# EAGLE schematic debugger_board (EAGLE 6.6.0)
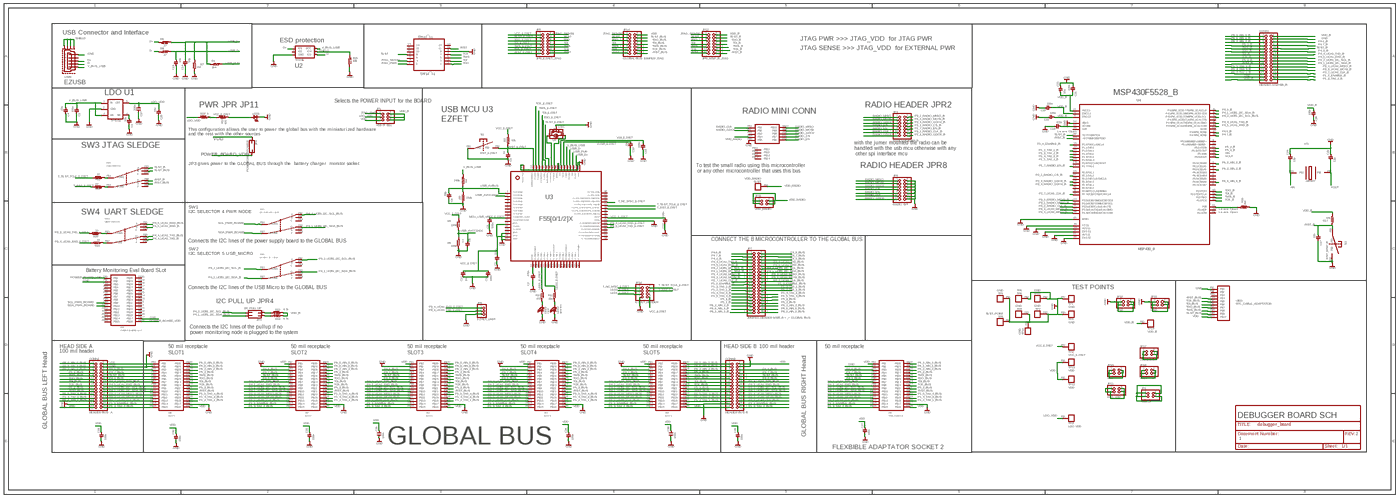
[diagram p0: schematic, sheet 1, overview]
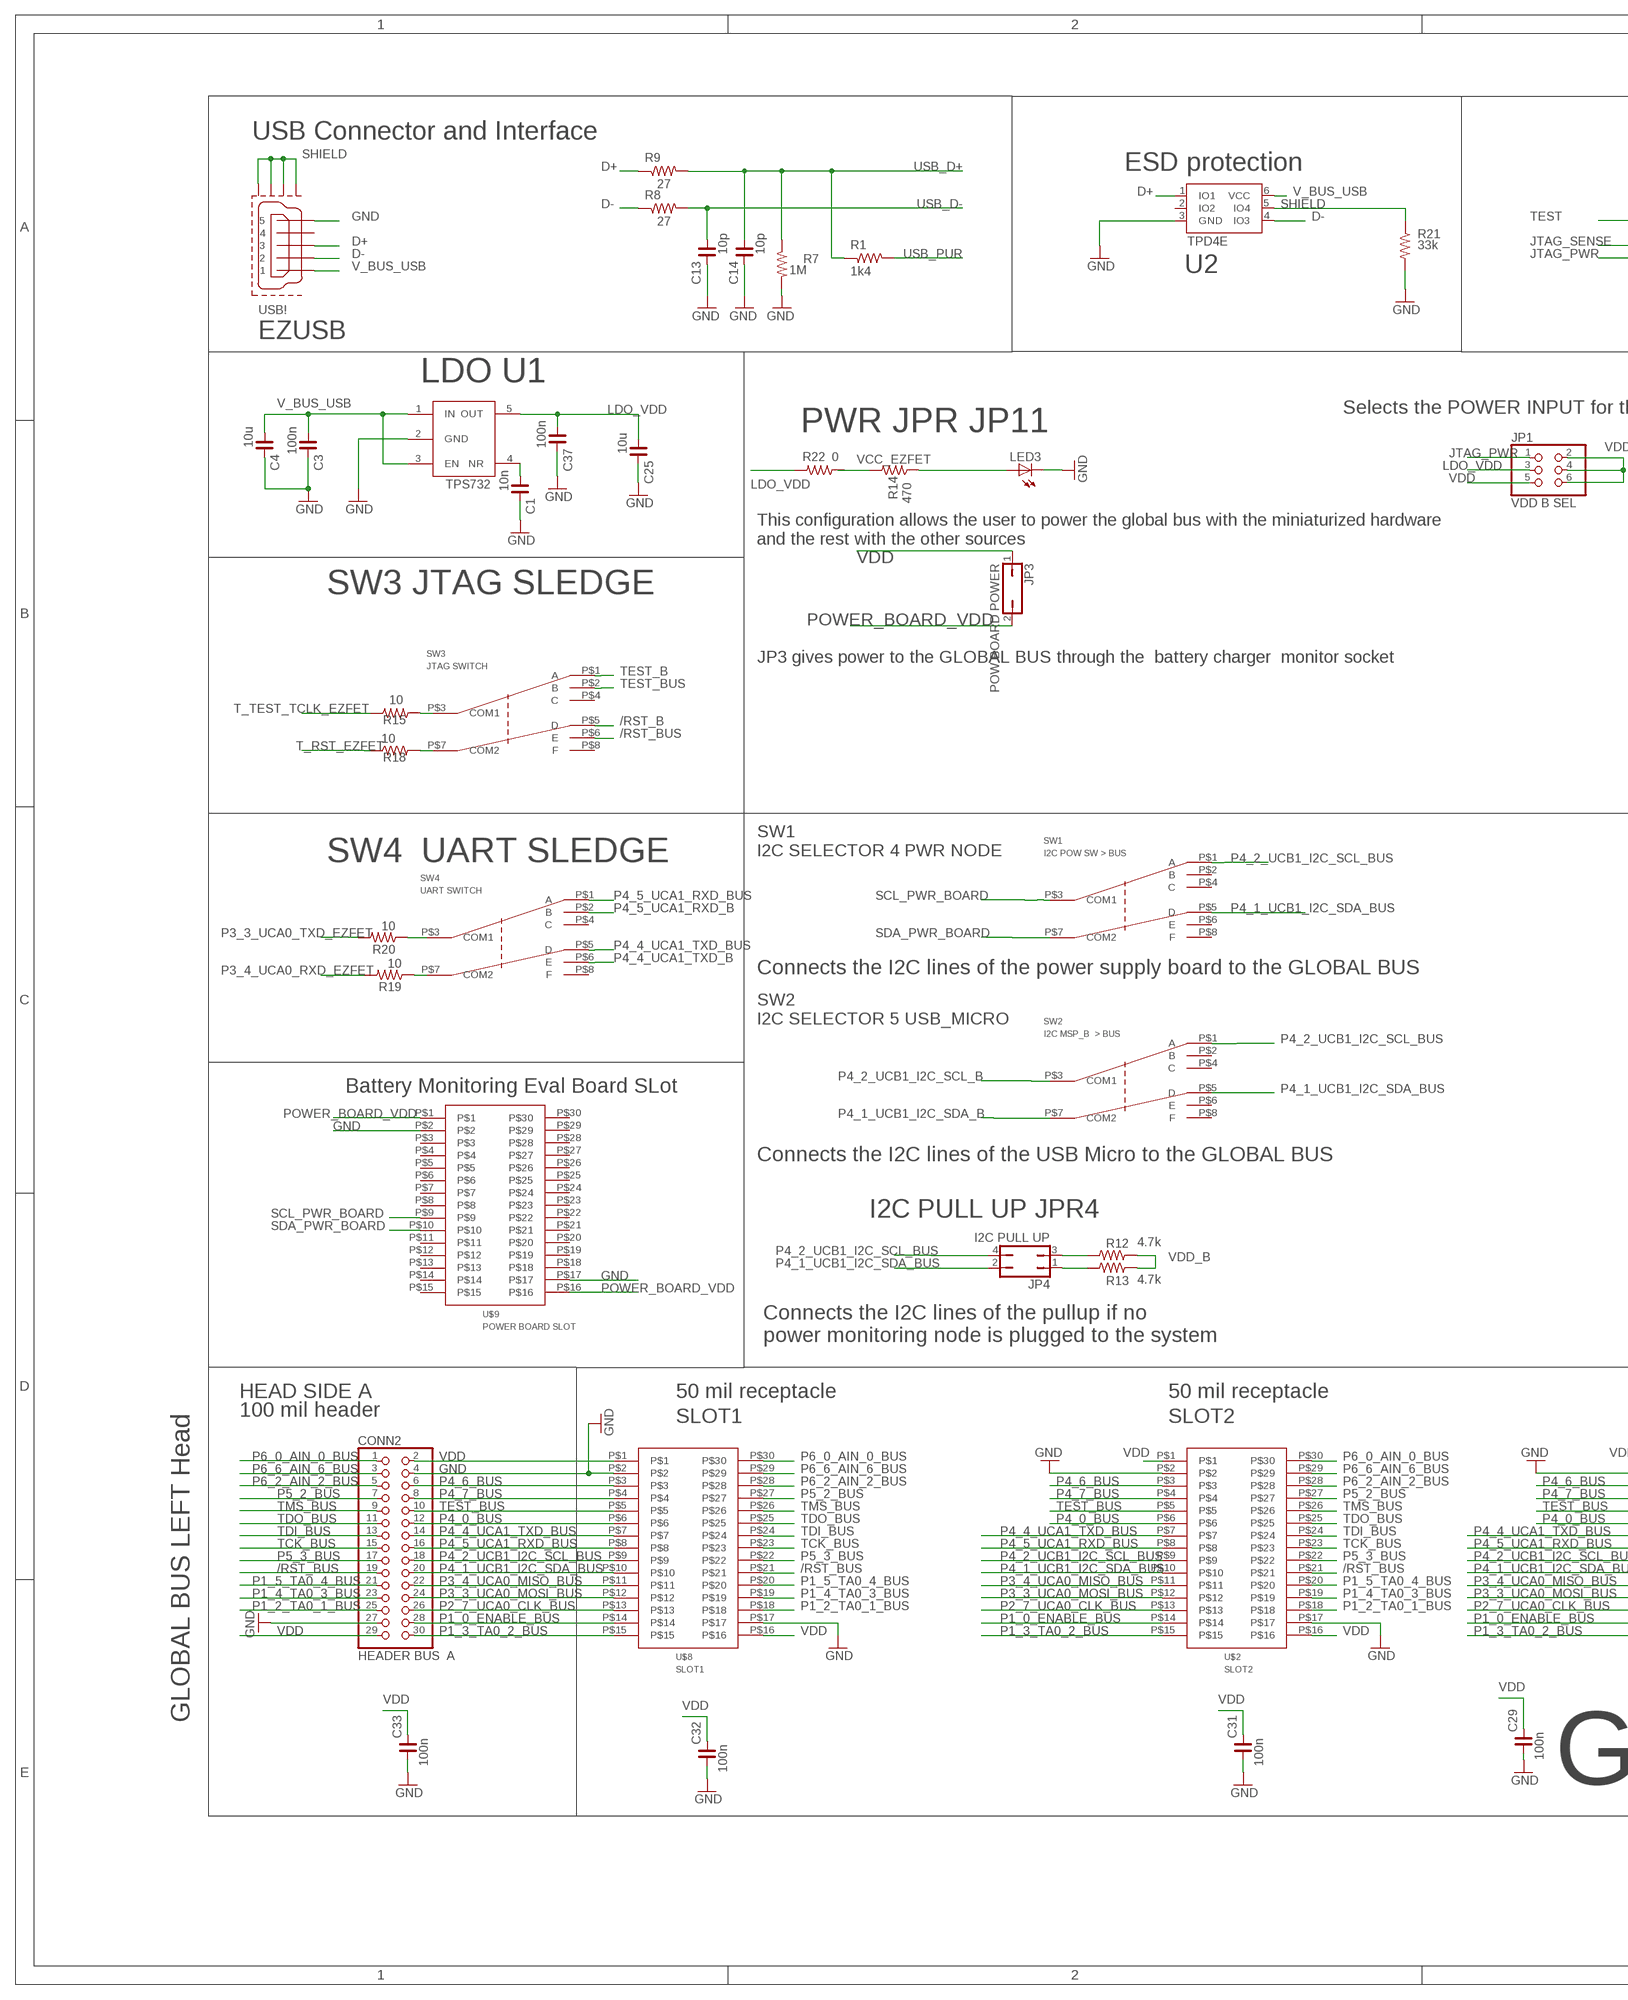
[diagram p1: schematic, sheet 1, part 1 of 4]
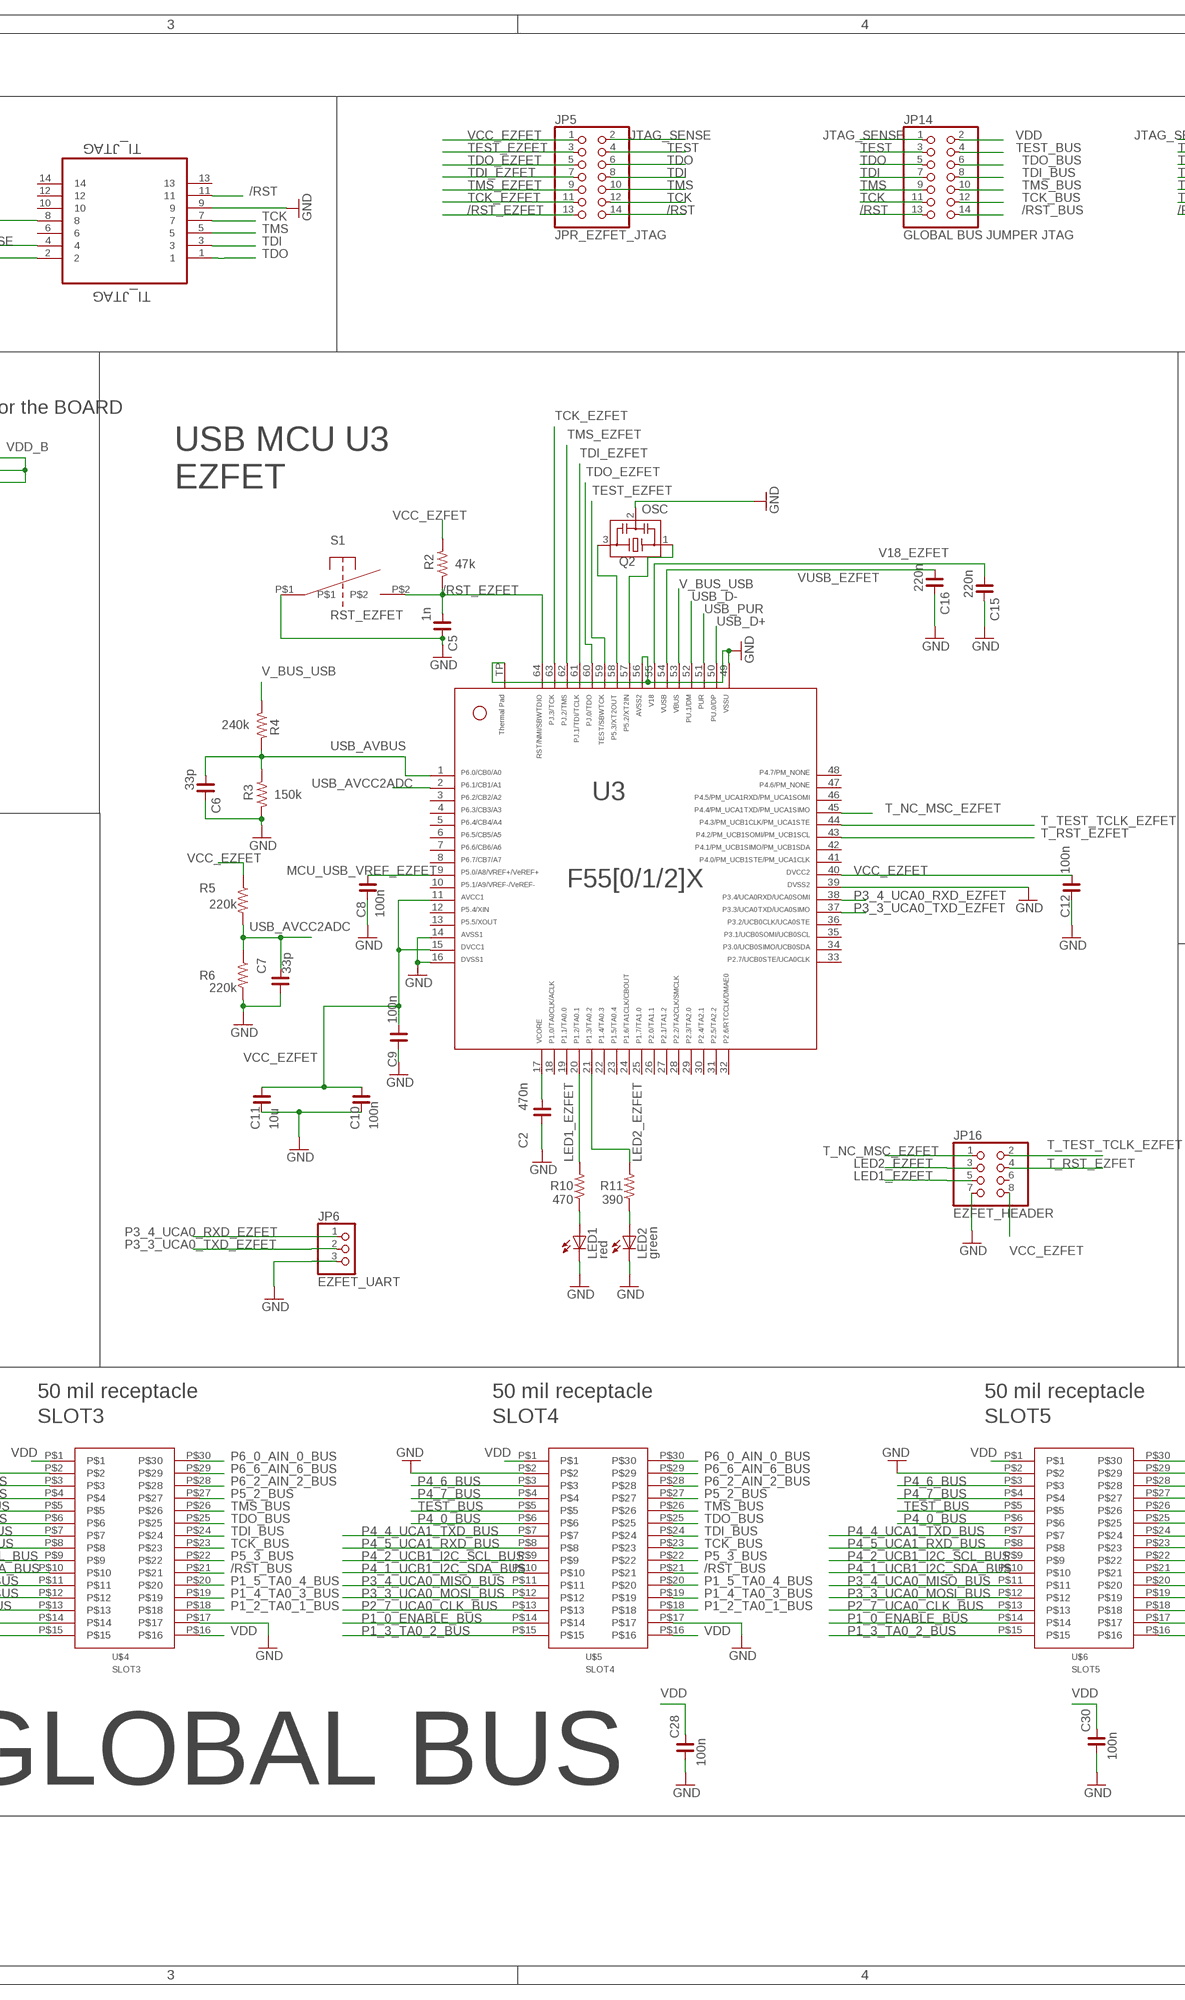
[diagram p2: schematic, sheet 1, part 2 of 4]
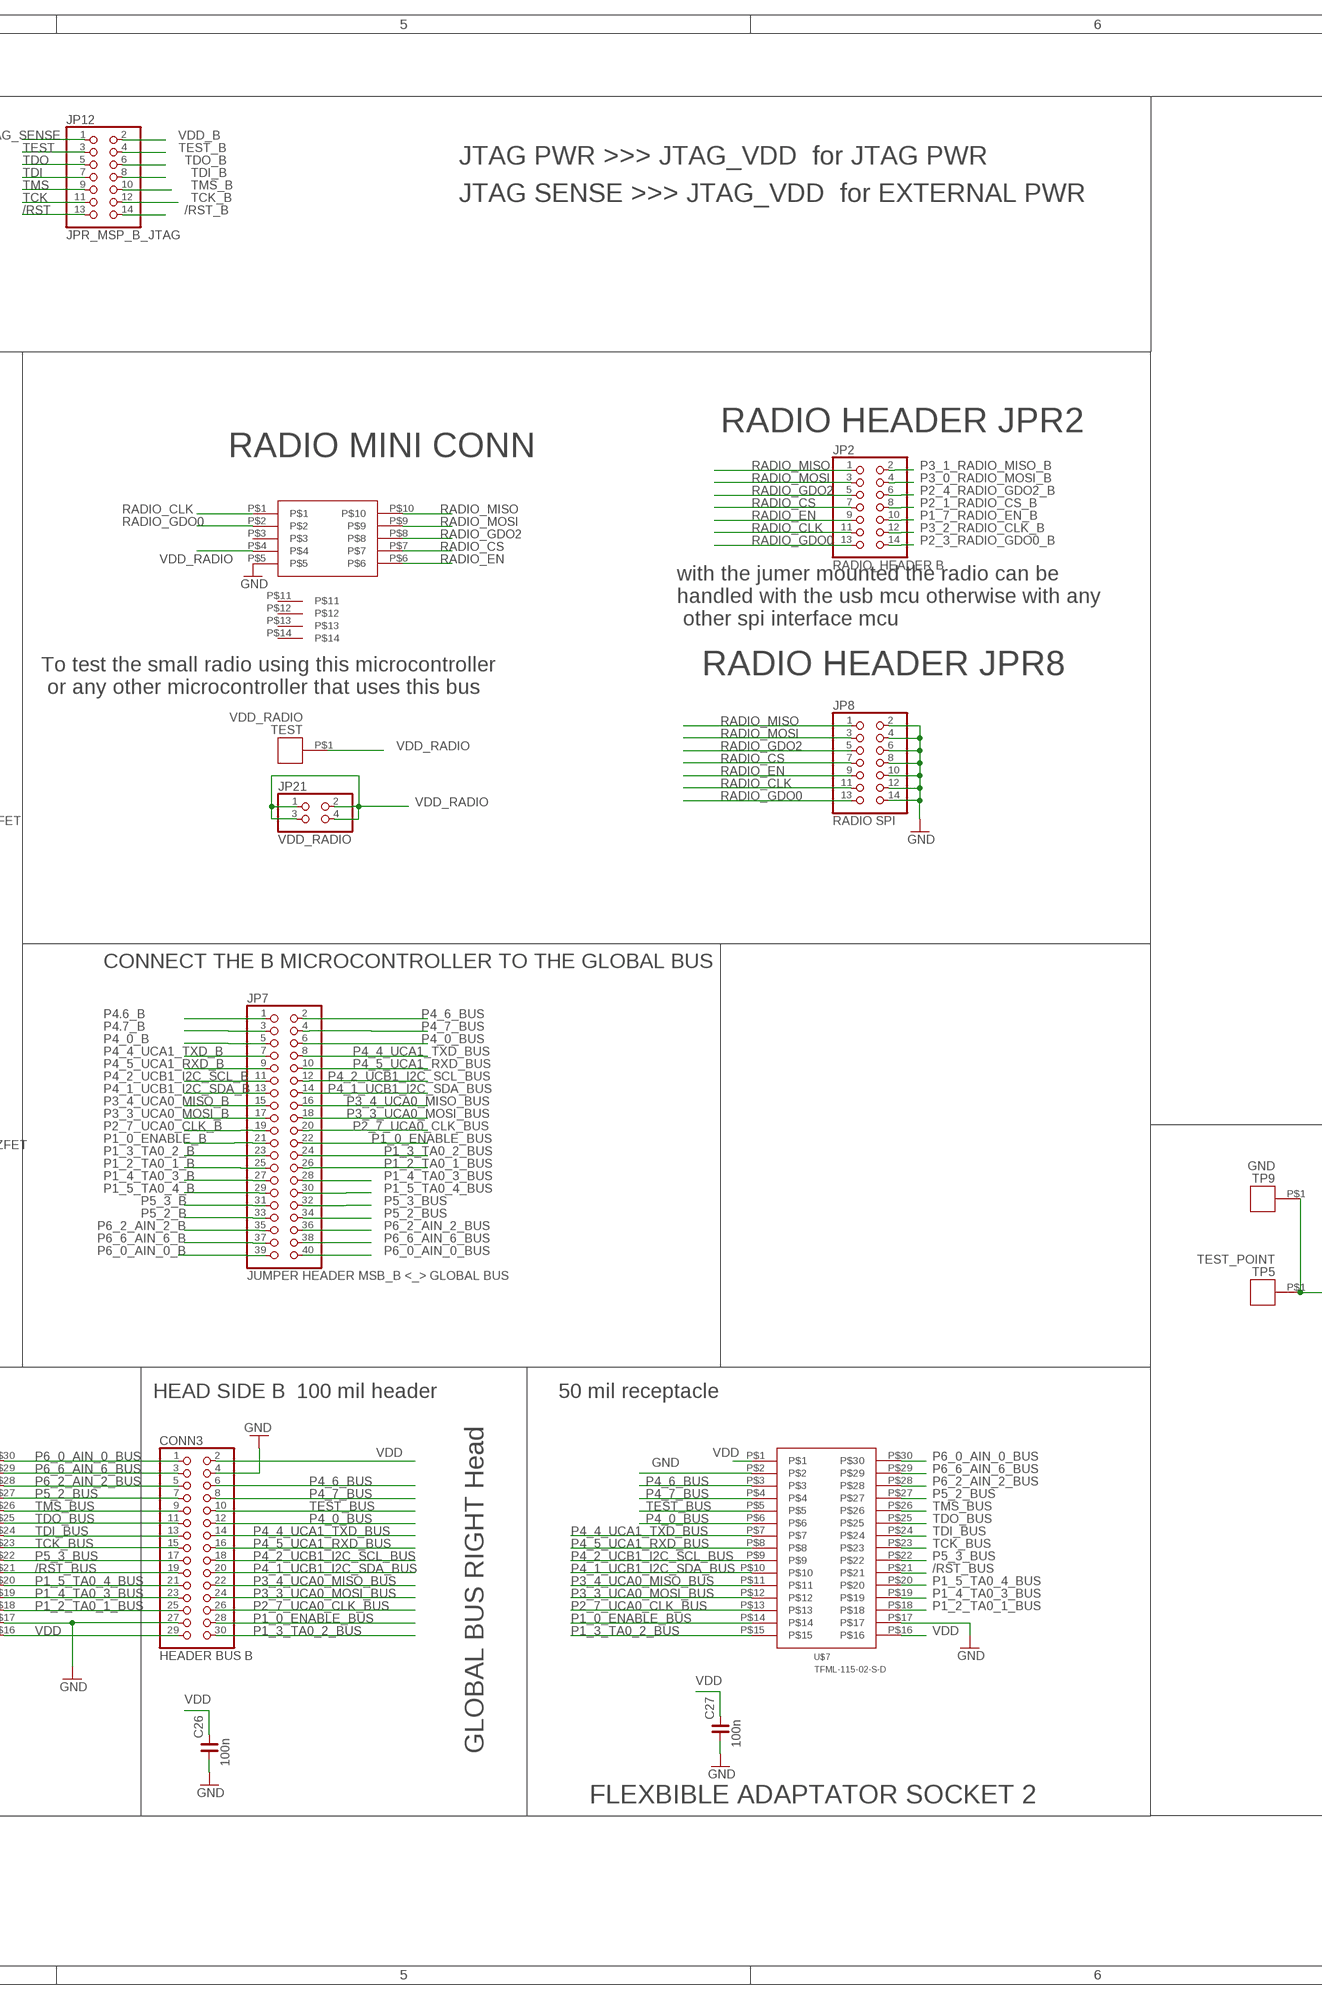
[diagram p3: schematic, sheet 1, part 3 of 4]
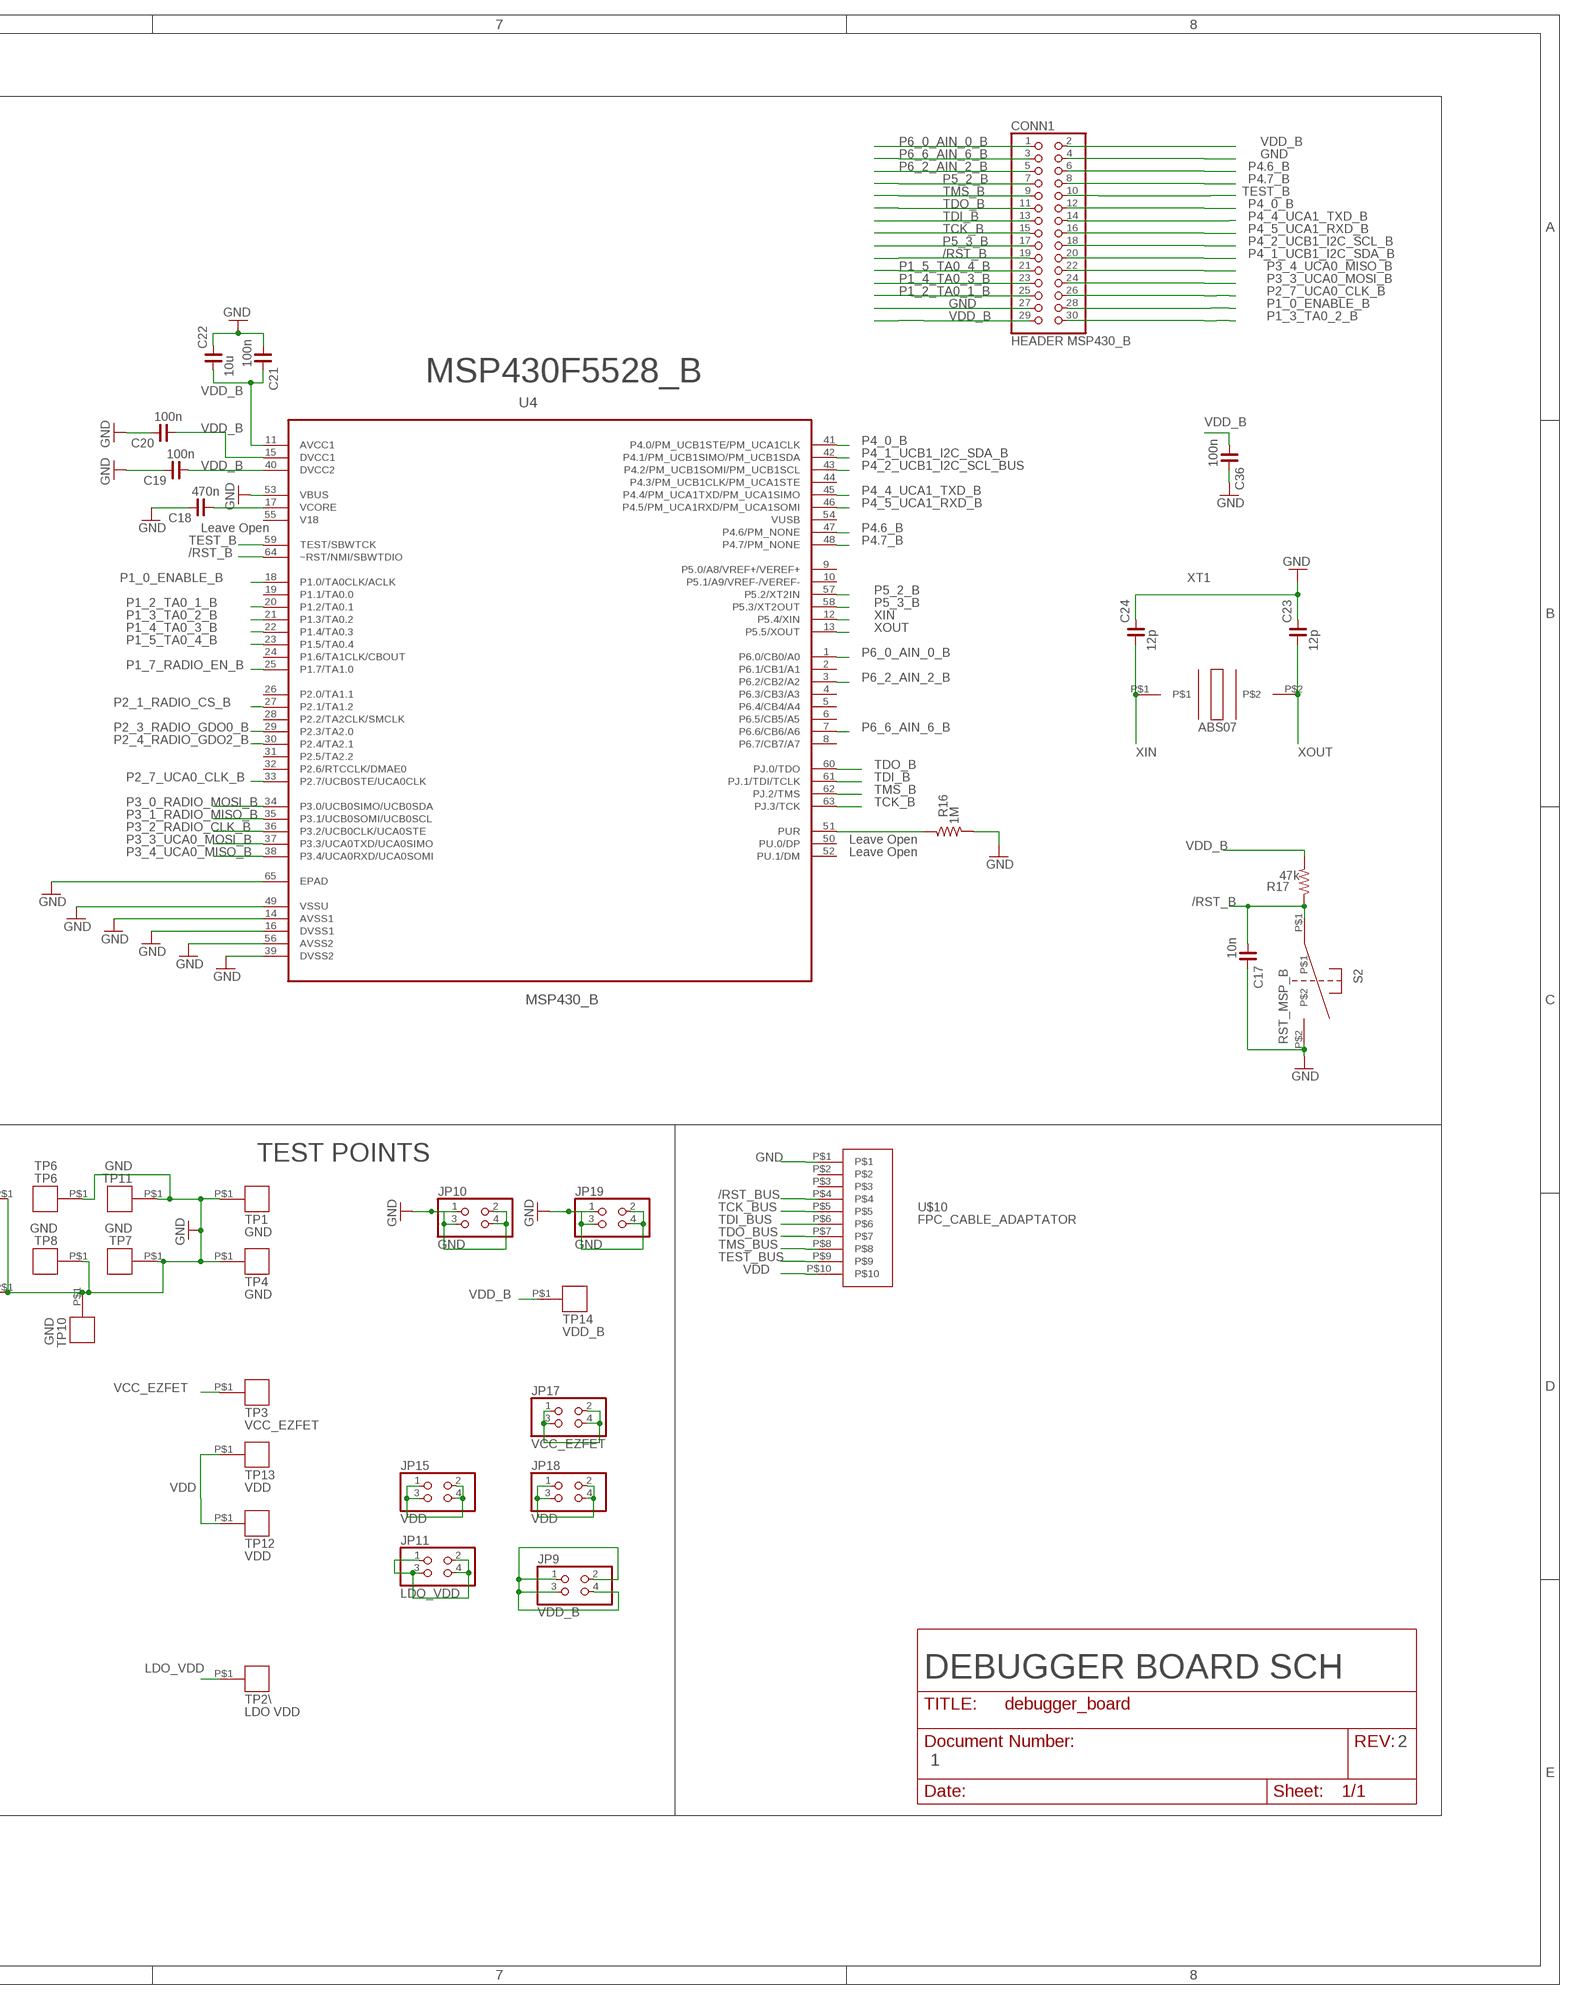
[diagram p4: schematic, sheet 1, part 4 of 4]

## Parts
C1  10n  C_0603  [C0603]
C2  470n  C_0603  [C0603]
C3  100n  C_0603  [C0603]
C4  10u  C_0603  [C0603]
C5  1n  C_0603  [C0603]
C6  33p  C_0603  [C0603]
C7  33p  C_0603  [C0603]
C8  100n  C_0603  [C0603]
C9  100n  C_0603  [C0603]
C10  100n  C_0603  [C0603]
C11  10u  C_0603  [C0603]
C12  100n  C_0603  [C0603]
C13  10p  C_0603  [C0603]
C14  10p  C_0603  [C0603]
C15  220n  C_0603  [C0603]
C16  220n  C_0603  [C0603]
C17  10n  C_0603  [C0603]
C18  470n  C_0603  [C0603]
C19  100n  C_0603  [C0603]
C20  100n  C_0603  [C0603]
C21  100n  C_0603  [C0603]
C22  10u  C_0603  [C0603]
C23  12p  C_0603  [C0603]
C24  12p  C_0603  [C0603]
C25  10u  C_0603  [C0603]
C26  100n  C_0603  [C0603]
C27  100n  C_0603  [C0603]
C28  100n  C_0603  [C0603]
C29  100n  C_0603  [C0603]
C30  100n  C_0603  [C0603]
C31  100n  C_0603  [C0603]
C32  100n  C_0603  [C0603]
C33  100n  C_0603  [C0603]
C36  100n  C_0603  [C0603]
C37  100n  C_0603  [C0603]
CONN1  HEADER MSP430_B  PINHD-2X15  [2X15]
CONN2  HEADER BUS A  PINHD-2X15  [2X15]
CONN3  HEADER BUS B  PINHD-2X15  [2X15]
EZUSB  USB!  MINI-USB-SHIELD-UX60A-MB-5ST  [UX60A-MB-5ST]
JP1  VDD B SEL  PINHD-2X3  [2X03]
JP2  RADIO_HEADER B  PINHD-2X7  [2X07]
JP3  POW BOARD POWER  JP1Q  [JP1]
JP4  I2C PULL UP  JP2Q  [JP2Q]
JP5  JPR_EZFET_JTAG  PINHD-2X7  [2X07]
JP6  EZFET_UART  PINHD-1X3  [1X03]
JP7  JUMPER HEADER MSB_B <_> GLOBAL BUS  PINHD-2X20  [2X20]
JP8  RADIO SPI  PINHD-2X7  [2X07]
JP9  VDD_B  PINHD-2X2  [2X02]
JP10  GND  PINHD-2X2  [2X02]
JP11  LDO_VDD  PINHD-2X2  [2X02]
JP12  JPR_MSP_B_JTAG  PINHD-2X7  [2X07]
JP14  GLOBAL BUS JUMPER JTAG  PINHD-2X7  [2X07]
JP15  VDD  PINHD-2X2  [2X02]
JP16  EZFET_HEADER  PINHD-2X4  [2X04]
JP17  VCC_EZFET  PINHD-2X2  [2X02]
JP18  VDD  PINHD-2X2  [2X02]
JP19  GND  PINHD-2X2  [2X02]
JP21  VDD_RADIO  PINHD-2X2  [2X02]
LED1  red  LEDCHIP-LED0603  [CHIP-LED0603]
LED2  green  LEDCHIP-LED0603  [CHIP-LED0603]
LED3  LEDCHIP-LED0603  [CHIP-LED0603]
Q2  OSC  CSTCR6M00G53Z  [CSTCR6M]
R1  1k4  R_0603  [R0603]
R2  47k  R_0603  [R0603]
R3  150k  R_0603  [R0603]
R4  240k  R_0603  [R0603]
R5  220k  R_0603  [R0603]
R6  220k  R_0603  [R0603]
R7  1M  R_0603  [R0603]
R8  27  R_0603  [R0603]
R9  27  R_0603  [R0603]
R10  470  R_0603  [R0603]
R11  390  R_0603  [R0603]
R12  4.7k  R_0603  [R0603]
R13  4.7k  R_0603  [R0603]
R14  470  R_0603  [R0603]
R15  10  R_0603  [R0603]
R16  1M  R_0603  [R0603]
R17  47k  R_0603  [R0603]
R18  10  R_0603  [R0603]
R19  10  R_0603  [R0603]
R20  10  R_0603  [R0603]
R21  33k  R_0603  [R0603]
R22  0  R_1206  [R1206]
RADIO_CONN  RADIO  559099872_2X5_PLUG  [559099872_2X5_PLUG]
S1  RST_EZFET  PUSH_BOT  [EVQ_11_TH]
S2  RST_MSP_B  PUSH_BOT  [EVQ_11_TH]
SW1  I2C POW SW > BUS  SWITCH_SLEDGE_3POS  [CL-SB-23B-02]
SW2  I2C MSP_B > BUS  SWITCH_SLEDGE_3POS  [CL-SB-23B-02]
SW3  JTAG SWITCH  SWITCH_SLEDGE_3POS  [CL-SB-23B-02]
SW4  UART SWITCH  SWITCH_SLEDGE_3POS  [CL-SB-23B-02]
TEST  VDD_RADIO  TEST_POINT  [5019_PAD]
TI_JTAG  TI_JTAG  5103308-2  [TYCO_5103308-2]
TP1  GND  TEST_POINT  [5019_PAD]
TP2\  LDO VDD  TEST_POINT  [5019_PAD]
TP3  VCC_EZFET  TEST_POINT  [5019_PAD]
TP4  GND  TEST_POINT  [5019_PAD]
TP5  TEST_POINT  [5019_PAD]
TP6  TP6  TEST_POINT  [5019_PAD]
TP7  GND  TEST_POINT  [5019_PAD]
TP8  GND  TEST_POINT  [5019_PAD]
TP9  GND  TEST_POINT  [5019_PAD]
TP10  GND  TEST_POINT  [5019_PAD]
TP11  GND  TEST_POINT  [5019_PAD]
TP12  VDD  TEST_POINT  [5019_PAD]
TP13  VDD  TEST_POINT  [5019_PAD]
TP14  VDD_B  TEST_POINT  [5019_PAD]
U1  TPS73233  TPS732XX  [SOT23]
U2  TPD4E  TPD4E004  [SON(DRY)6]
U3  USB_EZFET  F55[0/1/2]X---RGC64  [RGC64]
U4  MSP430_B  MSP430F5528IRGCT  [QFN50P900X900X100-65N]
U$2  SLOT2  TFML-115-02-S-D  [TFML-115-02-S-D]
U$4  SLOT3  TFML-115-02-S-D  [TFML-115-02-S-D]
U$5  SLOT4  TFML-115-02-S-D  [TFML-115-02-S-D]
U$6  SLOT5  TFML-115-02-S-D  [TFML-115-02-S-D]
U$7  TFML-115-02-S-D  [TFML-115-02-S-D]
U$8  SLOT1  TFML-115-02-S-D  [TFML-115-02-S-D]
U$9  POWER BOARD SLOT  TFML-115-02-S-D  [TFML-115-02-S-D]
U$10  FPC_CABLE_ADAPTATOR  CABLE_ADAPTATOR  [FPC_FFC]
U$16  OSC32K  [ABS07]

## Nets
/RST [net]: JP5.14 JP12.13 JP14.13 TI_JTAG.11
/RST_B: C17.1 CONN1.19 JP12.14 R17.1 S2.P$1 SW3.P$5(D) U4.64(~RST/NMI/SBWTDIO)
/RST_BUS [net]: CONN2.19 CONN3.19 JP14.14 SW3.P$6(E) U$2.P$21 U$4.P$21 U$5.P$21 U$6.P$21 U$7.P$21 U$8.P$21 U$10.P$4
/RST_EZFET: C5.1 JP5.13 R2.1 S1.P$2 U3.64
D+: EZUSB.3 R9.1 U2.1(IO1)
D-: EZUSB.2 R8.1 U2.4(IO3)
GND [power]: C1.2 C2.2 C3.2 C4.2 C5.2 C6.2 C7.1 C8.1 C9.1 C10.1 C11.1 C12.1 C13.2 C14.2 C15.2 C16.2 C17.2 C18.2 C19.2 C20.2 C21.1 C22.2 C23.2 C24.2 C25.2 C26.1 C27.1 C28.1 C29.1 C30.1 C31.1 C32.1 C33.1 C36.2 C37.2 CONN1.4 CONN1.27 CONN2.4 CONN2.27 CONN3.4 CONN3.27 EZUSB.5 JP6.3 JP8.2 JP8.4 JP8.6 JP8.8 JP8.10 JP8.12 JP8.14 JP10.1 JP10.2 JP10.3 JP10.4 JP16.7 JP19.1 JP19.2 JP19.3 JP19.4 LED1.C LED2.C LED3.C Q2.2 R3.1 R6.2 R7.2 R16.2 R21.2 RADIO_CONN.P$5 S1.P$1 S2.P$2 TI_JTAG.9 TP1.P$1 TP4.P$1 TP5.P$1 TP6.P$1 TP7.P$1 TP8.P$1 TP9.P$1 TP10.P$1 TP11.P$1 U1.2(GND) U2.3(GND) U3.14 U3.16 U3.39 U3.49 U3.56 U3.TP U4.14(AVSS1) U4.16(DVSS1) U4.39(DVSS2) U4.49(VSSU) U4.53(VBUS) U4.56(AVSS2) U4.65(EPAD) U$2.P$2 U$2.P$17 U$4.P$2 U$4.P$17 U$5.P$2 U$5.P$17 U$6.P$2 U$6.P$17 U$7.P$2 U$7.P$17 U$8.P$2 U$8.P$17 U$9.P$2 U$9.P$17 U$10.P$1
JTAG_PWR [power]: JP1.1 TI_JTAG.2
JTAG_SENSE [net]: JP5.2 JP12.1 JP14.1 TI_JTAG.4
LDO_VDD: C25.1 C37.1 JP1.3 JP11.1 JP11.2 JP11.3 JP11.4 R22.2 TP2\.P$1 U1.5(OUT)
LED1_EZFET: JP16.5 R10.2 U3.20
LED2_EZFET: JP16.3 R11.2 U3.21
MCU_USB_VREF_EZFET: C8.2 U3.9
N$1: C18.1 U4.17(VCORE)
N$2: R16.1 U4.51(PUR)
N$3: JP4.1 R13.1
N$4: C1.1 U1.4(NR)
N$6: Q2.3 U3.58
N$7: Q2.1 U3.57
N$8: C2.1 U3.17
N$9: LED3.A R14.1
N$10: LED1.A R10.1
N$11: LED2.A R11.1
N$12: JP4.3 R12.1
N$13: R15.1 SW3.P$3(COM1)
N$14: R18.2 SW3.P$7(COM2)
N$17: R20.1 SW4.P$3(COM1)
N$18: R19.1 SW4.P$7(COM2)
P1_0_ENABLE_B: CONN1.28 JP7.21 U4.18(P1.0/TA0CLK/ACLK)
P1_0_ENABLE_BUS [net]: CONN2.28 CONN3.28 JP7.22 U$2.P$14 U$4.P$14 U$5.P$14 U$6.P$14 U$7.P$14 U$8.P$14
P1_2_TA0_1_B: CONN1.25 JP7.25 U4.20(P1.2/TA0.1)
P1_2_TA0_1_BUS [net]: CONN2.25 CONN3.25 JP7.26 U$2.P$18 U$4.P$18 U$5.P$18 U$6.P$18 U$7.P$18 U$8.P$18
P1_3_TA0_2_B: CONN1.30 JP7.23 U4.21(P1.3/TA0.2)
P1_3_TA0_2_BUS [net]: CONN2.30 CONN3.30 JP7.24 U$2.P$15 U$4.P$15 U$5.P$15 U$6.P$15 U$7.P$15 U$8.P$15
P1_4_TA0_3_B: CONN1.23 JP7.27 U4.22(P1.4/TA0.3)
P1_4_TA0_3_BUS [net]: CONN2.23 CONN3.23 JP7.28 U$2.P$19 U$4.P$19 U$5.P$19 U$6.P$19 U$7.P$19 U$8.P$19
P1_5_TA0_4_B: CONN1.21 JP7.29 U4.23(P1.5/TA0.4)
P1_5_TA0_4_BUS [net]: CONN2.21 CONN3.21 JP7.30 U$2.P$20 U$4.P$20 U$5.P$20 U$6.P$20 U$7.P$20 U$8.P$20
P1_7_RADIO_EN_B: JP2.10 U4.25(P1.7/TA1.0)
P2_1_RADIO_CS_B: JP2.8 U4.27(P2.1/TA1.2)
P2_3_RADIO_GDO0_B: JP2.14 U4.29(P2.3/TA2.0)
P2_4_RADIO_GDO2_B: JP2.6 U4.30(P2.4/TA2.1)
P2_7_UCA0_CLK_B: CONN1.26 JP7.19 U4.33(P2.7/UCB0STE/UCA0CLK)
P2_7_UCA0_CLK_BUS [net]: CONN2.26 CONN3.26 JP7.20 U$2.P$13 U$4.P$13 U$5.P$13 U$6.P$13 U$7.P$13 U$8.P$13
P3_0_RADIO_MOSI_B: JP2.4 U4.34(P3.0/UCB0SIMO/UCB0SDA)
P3_1_RADIO_MISO_B: JP2.2 U4.35(P3.1/UCB0SOMI/UCB0SCL)
P3_2_RADIO_CLK_B: JP2.12 U4.36(P3.2/UCB0CLK/UCA0STE)
P3_3_UCA0_MOSI_B: CONN1.24 JP7.17 U4.37(P3.3/UCA0TXD/UCA0SIMO)
P3_3_UCA0_MOSI_BUS [net]: CONN2.24 CONN3.24 JP7.18 U$2.P$12 U$4.P$12 U$5.P$12 U$6.P$12 U$7.P$12 U$8.P$12
P3_3_UCA0_TXD_EZFET: JP6.2 R20.2 U3.37
P3_4_UCA0_MISO_B: CONN1.22 JP7.15 U4.38(P3.4/UCA0RXD/UCA0SOMI)
P3_4_UCA0_MISO_BUS [net]: CONN2.22 CONN3.22 JP7.16 U$2.P$11 U$4.P$11 U$5.P$11 U$6.P$11 U$7.P$11 U$8.P$11
P3_4_UCA0_RXD_EZFET: JP6.1 R19.2 U3.38
P4.6_B: CONN1.6 JP7.1 U4.47(P4.6/PM_NONE)
P4.7_B: CONN1.8 JP7.3 U4.48(P4.7/PM_NONE)
P4_0_B: CONN1.12 JP7.5 U4.41(P4.0/PM_UCB1STE/PM_UCA1CLK)
P4_0_BUS [net]: CONN2.12 CONN3.12 JP7.6 U$2.P$6 U$4.P$6 U$5.P$6 U$6.P$6 U$7.P$6 U$8.P$6
P4_1_UCB1_I2C_SDA_B: CONN1.20 JP7.13 SW2.P$7(COM2) U4.42(P4.1/PM_UCB1SIMO/PM_UCB1SDA)
P4_1_UCB1_I2C_SDA_BUS [net]: CONN2.20 CONN3.20 JP4.2 JP7.14 SW1.P$5(D) SW2.P$5(D) U$2.P$10 U$4.P$10 U$5.P$10 U$6.P$10 U$7.P$10 U$8.P$10
P4_2_UCB1_I2C_SCL_B: CONN1.18 JP7.11 SW2.P$3(COM1)
P4_2_UCB1_I2C_SCL_BUS [net]: CONN2.18 CONN3.18 JP4.4 JP7.12 SW1.P$1(A) SW2.P$1(A) U4.43(P4.2/PM_UCB1SOMI/PM_UCB1SCL) U$2.P$9 U$4.P$9 U$5.P$9 U$6.P$9 U$7.P$9 U$8.P$9
P4_4_UCA1_TXD_B: CONN1.14 JP7.7 SW4.P$6(E) U4.45(P4.4/PM_UCA1TXD/PM_UCA1SIMO)
P4_4_UCA1_TXD_BUS [net]: CONN2.14 CONN3.14 JP7.8 SW4.P$5(D) U$2.P$7 U$4.P$7 U$5.P$7 U$6.P$7 U$7.P$7 U$8.P$7
P4_5_UCA1_RXD_B: CONN1.16 JP7.9 SW4.P$2(B) U4.46(P4.5/PM_UCA1RXD/PM_UCA1SOMI)
P4_5_UCA1_RXD_BUS [net]: CONN2.16 CONN3.16 JP7.10 SW4.P$1(A) U$2.P$8 U$4.P$8 U$5.P$8 U$6.P$8 U$7.P$8 U$8.P$8
P4_6_BUS [net]: CONN2.6 CONN3.6 JP7.2 U$2.P$3 U$4.P$3 U$5.P$3 U$6.P$3 U$7.P$3 U$8.P$3
P4_7_BUS [net]: CONN2.8 CONN3.8 JP7.4 U$2.P$4 U$4.P$4 U$5.P$4 U$6.P$4 U$7.P$4 U$8.P$4
P5_2_B: CONN1.7 JP7.33 U4.57(P5.2/XT2IN)
P5_2_BUS [net]: CONN2.7 CONN3.7 JP7.34 U$2.P$27 U$4.P$27 U$5.P$27 U$6.P$27 U$7.P$27 U$8.P$27
P5_3_B: CONN1.17 JP7.31 U4.58(P5.3/XT2OUT)
P5_3_BUS [net]: CONN2.17 CONN3.17 JP7.32 U$2.P$22 U$4.P$22 U$5.P$22 U$6.P$22 U$7.P$22 U$8.P$22
P6_0_AIN_0_B: CONN1.1 JP7.39 U4.1(P6.0/CB0/A0)
P6_0_AIN_0_BUS [net]: CONN2.1 CONN3.1 JP7.40 U$2.P$30 U$4.P$30 U$5.P$30 U$6.P$30 U$7.P$30 U$8.P$30
P6_2_AIN_2_B: CONN1.5 JP7.35 U4.3(P6.2/CB2/A2)
P6_2_AIN_2_BUS [net]: CONN2.5 CONN3.5 JP7.36 U$2.P$28 U$4.P$28 U$5.P$28 U$6.P$28 U$7.P$28 U$8.P$28
P6_6_AIN_6_B: CONN1.3 JP7.37 U4.7(P6.6/CB6/A6)
P6_6_AIN_6_BUS [net]: CONN2.3 CONN3.3 JP7.38 U$2.P$29 U$4.P$29 U$5.P$29 U$6.P$29 U$7.P$29 U$8.P$29
POWER_BOARD_VDD: JP3.2 U$9.P$1 U$9.P$16
RADIO_CLK: JP2.11 JP8.11 RADIO_CONN.P$1
RADIO_CS: JP2.7 JP8.7 RADIO_CONN.P$7
RADIO_EN: JP2.9 JP8.9 RADIO_CONN.P$6
RADIO_GDO0: JP2.13 JP8.13 RADIO_CONN.P$2
RADIO_GDO2: JP2.5 JP8.5 RADIO_CONN.P$8
RADIO_MISO: JP2.1 JP8.1 RADIO_CONN.P$10
RADIO_MOSI: JP2.3 JP8.3 RADIO_CONN.P$9
SCL_PWR_BOARD: SW1.P$3(COM1) U$9.P$9
SDA_PWR_BOARD: SW1.P$7(COM2) U$9.P$10
SHIELD: EZUSB.M1(GND1) EZUSB.M2(GND2) EZUSB.M3(GND3) EZUSB.M4(GND4) R21.1 U2.5(IO4)
T_NC_MSC_EZFET: JP16.1 U3.45
T_RST_EZFET: JP16.4 R18.1 U3.43
T_TEST_TCLK_EZFET: JP16.2 R15.2 U3.44
TCK [net]: JP5.12 JP12.11 JP14.11 TI_JTAG.7
TCK_B: CONN1.15 JP12.12 U4.63(PJ.3/TCK)
TCK_BUS [net]: CONN2.15 CONN3.15 JP14.12 U$2.P$23 U$4.P$23 U$5.P$23 U$6.P$23 U$7.P$23 U$8.P$23 U$10.P$5
TCK_EZFET: JP5.11 U3.63
TDI [net]: JP5.8 JP12.7 JP14.7 TI_JTAG.3
TDI_B: CONN1.13 JP12.8 U4.61(PJ.1/TDI/TCLK)
TDI_BUS [net]: CONN2.13 CONN3.13 JP14.8 U$2.P$24 U$4.P$24 U$5.P$24 U$6.P$24 U$7.P$24 U$8.P$24 U$10.P$6
TDI_EZFET: JP5.7 U3.61
TDO [net]: JP5.6 JP12.5 JP14.5 TI_JTAG.1
TDO_B: CONN1.11 JP12.6 U4.60(PJ.0/TDO)
TDO_BUS [net]: CONN2.11 CONN3.11 JP14.6 U$2.P$25 U$4.P$25 U$5.P$25 U$6.P$25 U$7.P$25 U$8.P$25 U$10.P$7
TDO_EZFET: JP5.5 U3.60
TEST [net]: JP5.4 JP12.3 JP14.3 TI_JTAG.8
TEST_B: CONN1.10 JP12.4 SW3.P$1(A) U4.59(TEST/SBWTCK)
TEST_BUS [net]: CONN2.10 CONN3.10 JP14.4 SW3.P$2(B) U$2.P$5 U$4.P$5 U$5.P$5 U$6.P$5 U$7.P$5 U$8.P$5 U$10.P$9
TEST_EZFET: JP5.3 U3.59
TMS [net]: JP5.10 JP12.9 JP14.9 TI_JTAG.5
TMS_B: CONN1.9 JP12.10 U4.62(PJ.2/TMS)
TMS_BUS [net]: CONN2.9 CONN3.9 JP14.10 U$2.P$26 U$4.P$26 U$5.P$26 U$6.P$26 U$7.P$26 U$8.P$26 U$10.P$8
TMS_EZFET: JP5.9 U3.62
USB_AVBUS: C6.1 R3.2 R4.2 U3.1
USB_AVCC2ADC: C7.2 R5.2 R6.1 U3.2
USB_D+: C14.1 R1.1 R7.1 R9.2 U3.50
USB_D-: C13.1 R8.2 U3.52
USB_PUR: R1.2 U3.51
V18_EZFET: C15.1 U3.55
V_BUS_USB [power]: C3.1 C4.1 EZUSB.1 R4.1 U1.1(IN) U1.3(EN) U2.6(VCC) U3.53
VCC_EZFET [power]: C9.2 C10.2 C11.2 C12.2 JP5.1 JP16.8 JP17.1 JP17.2 JP17.3 JP17.4 R2.2 R5.1 R14.2 R22.1 TP3.P$1 U3.11 U3.15 U3.40
VDD [power]: C26.2 C27.2 C28.2 C29.2 C30.2 C31.2 C32.2 C33.2 CONN2.2 CONN2.29 CONN3.2 CONN3.29 JP1.5 JP3.1 JP14.2 JP15.1 JP15.2 JP15.3 JP15.4 JP18.1 JP18.2 JP18.3 JP18.4 TP12.P$1 TP13.P$1 U$2.P$1 U$2.P$16 U$4.P$1 U$4.P$16 U$5.P$1 U$5.P$16 U$6.P$1 U$6.P$16 U$7.P$1 U$7.P$16 U$8.P$1 U$8.P$16 U$10.P$10
VDD_B [power]: C19.1 C20.1 C21.2 C22.1 C36.1 CONN1.2 CONN1.29 JP1.2 JP1.4 JP1.6 JP9.1 JP9.2 JP9.3 JP9.4 JP12.2 R12.2 R13.2 R17.2 TP14.P$1 U4.11(AVCC1) U4.15(DVCC1) U4.40(DVCC2)
VDD_RADIO: JP21.1 JP21.2 JP21.3 JP21.4 RADIO_CONN.P$4 TEST.P$1
VUSB_EZFET: C16.1 U3.54
XIN: C24.1 U4.12(P5.4/XIN) U$16.P$1
XOUT: C23.1 U4.13(P5.5/XOUT) U$16.P$2
Unconnected: EZUSB.4 JP16.6 RADIO_CONN.P$3 RADIO_CONN.P$11 RADIO_CONN.P$12 RADIO_CONN.P$13 RADIO_CONN.P$14 SW1.P$2(B) SW1.P$4(C) SW1.P$6(E) SW1.P$8(F) SW2.P$2(B) SW2.P$4(C) SW2.P$6(E) SW2.P$8(F) SW3.P$4(C) SW3.P$8(F) SW4.P$4(C) SW4.P$8(F) TI_JTAG.6 TI_JTAG.10 TI_JTAG.12 TI_JTAG.13 TI_JTAG.14 U2.2(IO2) U3.3 U3.4 U3.5 U3.6 U3.7 U3.8 U3.10 U3.12 U3.13 U3.18 U3.19 U3.22 U3.23 U3.24 U3.25 U3.26 U3.27 U3.28 U3.29 U3.30 U3.31 U3.32 U3.33 U3.34 U3.35 U3.36 U3.41 U3.42 U3.46 U3.47 U3.48 U4.2(P6.1/CB1/A1) U4.4(P6.3/CB3/A3) U4.5(P6.4/CB4/A4) U4.6(P6.5/CB5/A5) U4.8(P6.7/CB7/A7) U4.9(P5.0/A8/VREF+/VEREF+) U4.10(P5.1/A9/VREF-/VEREF-) U4.19(P1.1/TA0.0) U4.24(P1.6/TA1CLK/CBOUT) U4.26(P2.0/TA1.1) U4.28(P2.2/TA2CLK/SMCLK) U4.31(P2.5/TA2.2) U4.32(P2.6/RTCCLK/DMAE0) U4.44(P4.3/PM_UCB1CLK/PM_UCA1STE) U4.50(PU.0/DP) U4.52(PU.1/DM) U4.54(VUSB) U$9.P$3 U$9.P$4 U$9.P$5 U$9.P$6 U$9.P$7 U$9.P$8 U$9.P$11 U$9.P$12 U$9.P$13 U$9.P$14 U$9.P$15 U$9.P$18 U$9.P$19 U$9.P$20 U$9.P$21 U$9.P$22 U$9.P$23 U$9.P$24 U$9.P$25 U$9.P$26 U$9.P$27 U$9.P$28 U$9.P$29 U$9.P$30 U$10.P$2 U$10.P$3

## Notes on the sheet
- USB Connector and Interface
- ESD protection | JTAG PWR >>> JTAG_VDD  for JTAG PWR
- JTAG SENSE >>> JTAG_VDD  for EXTERNAL PWR
- LDO U1 | MSP430F5528_B
- Selects the POWER INPUT for the BOARD
- PWR JPR JP11 | RADIO HEADER JPR2
- RADIO MINI CONN
- USB MCU U3 
  EZFET
- Leave Open
- This configuration allows the user to power the global bus with the miniaturized hardware
  and the rest with the other sources
- XT1
- SW3 JTAG SLEDGE
- with the jumer mounted the radio can be 
  handled with the usb mcu otherwise with any
   other spi interface mcu
- JP3 gives power to the GLOBAL BUS through the  battery charger  monitor socket
- RADIO HEADER JPR8
- To test the small radio using this microcontroller
   or any other microcontroller that uses this bus
- Leave Open
- SW1
  I2C SELECTOR 4 PWR NODE
- Leave Open
- SW4  UART SLEDGE
- CONNECT THE B MICROCONTROLLER TO THE GLOBAL BUS
- Connects the I2C lines of the power supply board to the GLOBAL BUS
- SW2
  I2C SELECTOR 5 USB_MICRO
- Battery Monitoring Eval Board SLot
- Connects the I2C lines of the USB Micro to the GLOBAL BUS | TEST POINTS
- I2C PULL UP JPR4
- Connects the I2C lines of the pullup if no 
  power monitoring node is plugged to the system
- HEAD SIDE A | 50 mil receptacle | 50 mil receptacle | 50 mil receptacle | 50 mil receptacle | 50 mil receptacle | HEAD SIDE B | 100 mil header | 50 mil receptacle
- 100 mil header
- SLOT1 | SLOT2 | SLOT3 | SLOT4 | SLOT5
- GLOBAL BUS LEFT Head | DEBUGGER BOARD SCH
- 2
- GLOBAL BUS RIGHT Head
- 1
- GLOBAL BUS
- FLEXBIBLE ADAPTATOR SOCKET 2

## Power pins joined to a net without a drawn wire
V18: U4.55(V18)

## Library data of the parts
C1-C33 C36 C37 = rc-master-smd:C_: NON-POLARIZED CAP
CONN1-CONN3 = pinhead:PINHD-2X15: PIN HEADER
EZUSB = usb_con-update:MINI-USB-SHIELD-: MINI USB Connector Source: http://www.hirose.co.jp/cataloge_hp/e24000019.pdf
JP1 = pinhead:PINHD-2X3: PIN HEADER
JP2 JP5 JP8 JP12 JP14 = pinhead:PINHD-2X7: PIN HEADER
JP3 = jumper:JP1Q: JUMPER
JP4 = jumper:JP2Q: JUMPER
JP6 = pinhead:PINHD-1X3: PIN HEADER
JP7 = pinhead:PINHD-2X20: PIN HEADER
JP9-JP11 JP15 JP17-JP19 JP21 = pinhead:PINHD-2X2: PIN HEADER
JP16 = pinhead:PINHD-2X4: PIN HEADER
LED1-LED3 = led:LED: LED OSRAM: - CHIPLED LG R971, LG N971, LY N971, LG Q971, LY Q971, LO R971, LY R971 LH N974, LH R974 LS Q976, LO Q976, LY Q976 LO Q996 - Hyper CHIPLED LW Q18S LB Q993, LB Q99A, LB R99A - SideLED LS A670, LO A670, LY A670, LG A670, LP A670 LB A673, LV A673, LT A673, LW A673 LH A674 LY A675 LS A676, LA A676, LO A676, LY A676, LW A676 LS A679, LY A679, LG A679 - Hyper Micro SIDELED® LS Y876, LA Y876, LO Y876, LY Y876 LT Y87S - SmartLED LW L88C, LW L88S LB L89C, LB L89S, LG L890 LS L89K, LO L89K, LY L89K LS L896, LA L896, LO L896, LY L896 - TOPLED LS T670, LO T670, LY T670, LG T670, LP T670 LSG T670, LSP T670, LSY T670, LOP T670, LYG T670 LG T671, LOG T671, LSG T671 LB T673, LV T673, LT T673, LW T673 LH T674 LS T676, LA T676, LO T676, LY T676, LB T676, LH T676, LSB T676, LW T676 LB T67C, LV T67C, LT T67C, LS T67K, LO T67K, LY T67K, LW E67C LS E67B, LA E67B, LO E67B, LY E67B, LB E67C, LV E67C, LT E67C LW T67C LS T679, LY T679, LG T679 LS T770, LO T770, LY T770, LG T770, LP T770 LB T773, LV T773, LT T773, LW T773 LH T774 LS E675, LA E675, LY E675, LS T675 LS T776, LA T776, LO T776, LY T776, LB T776 LHGB T686 LT T68C, LB T68C - Hyper Mini TOPLED® LB M676 - Mini TOPLED Santana® LG M470 LS M47K, LO M47K, LY M47K Source: http://www.osram.convergy.de LUXEON: - LUMILED® LXK2-PW12-R00, LXK2-PW12-S00, LXK2-PW14-U00, LXK2-PW14-V00 LXK2-PM12-R00, LXK2-PM12-S00, LXK2-PM14-U00 LXK2-PE12-Q00, LXK2-PE12-R00, LXK2-PE12-S00, LXK2-PE14-T00, LXK2-PE14-U00 LXK2-PB12-K00, LXK2-PB12-L00, LXK2-PB12-M00, LXK2-PB14-N00, LXK2-PB14-P00, LXK2-PB14-Q00 LXK2-PR12-L00, LXK2-PR12-M00, LXK2-PR14-Q00, LXK2-PR14-R00 LXK2-PD12-Q00, LXK2-PD12-R00, LXK2-PD12-S00 LXK2-PH12-R00, LXK2-PH12-S00 LXK2-PL12-P00, LXK2-PL12-Q00, LXK2-PL12-R00 Source: www.luxeon.com KINGBRIGHT: KA-3528ASYC Source: www.kingbright.com
Q2 = murata-filter:CSTCR: Resonator Source: murata.co.jp; MPN: CSTCR6M00G53-R0; OC_FARNELL: 1170434; OC_NEWARK: 25M8759
R1-R22 = rc-master-smd:R_: RESISTOR
RADIO_CONN = Molex_SlimStack:559099872_2X5_PLUG
S1 S2 = push_botton:PUSH_BOT
SW1-SW4 = CL-SB-23B-02 sledge switch:SWITCH_SLEDGE_3POS
TEST TP1 TP2\ TP3-TP14 = TEST_POINT_KEYSTONE_5019:TEST_POINT
TI_JTAG = TI_CONNECTOR:5103308-2: HEADER, 2.54MM, 14WAY; MPN: 5103308-2; OC_FARNELL: 1772816; OC_NEWARK: 73K2063; PACKAGE: HEADER, 2.54MM, 14WAY; SUPPLIER: Tyco Electronics
U1 = TPS732xx:TPS732XX
U2 = eZFET:TPD4E004
U3 = TI_MSP430_v16:F55[0/1/2]X---RGC64: ***F55[0/1/2]X***RGC64 Rev. 1.0 06/2010 "http://www.ti.com/lit/gpn/msp430f5529" "http://www.ti.com/lit/gpn/msp430f5509" F5513/F5514 with limited Functions on some Pins
U4 = msp430f5528_variant:MSP430F5528IRGCT: MIXED SIGNAL MICROCONTROLLER; MPN: MSP430F5528IRGCT; OC_FARNELL: 1866820; OC_NEWARK: 74R6475; PACKAGE: VQFN-64; SUPPLIER: TEXAS INSTRUMENTS
U$2 U$4-U$9 = Samtec:TFML-115-02-S-D
U$10 = FPC_FFC_Cable:CABLE_ADAPTATOR
U$16 = ABS07:OSC32K

## Net classes
0 default: width 0.127 mm, clearance 0.127 mm
1 power: width 0.203 mm, clearance 0.127 mm
2 net: width 0.203 mm, clearance 0.127 mm